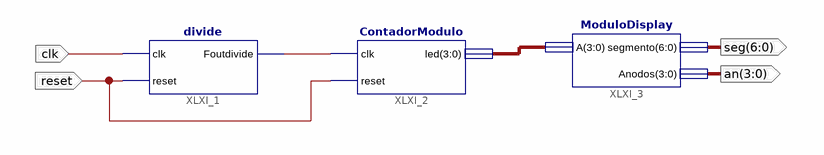
[diagram p0: schematic sheet 1]
// Xilinx ISE schematic SuperiorContadorModulo.sch (spartan6) as structural Verilog: 3 symbols, 4 ports
module SuperiorContadorModulo (
  input  clk,
  input  reset,
  output [6:0] seg,
  output [3:0] an
);

  wire XLXN_1;
  wire [3:0] XLXN_2;

  divide XLXI_1 (.clk(clk), .reset(reset), .Foutdivide(XLXN_1));
  ContadorModulo XLXI_2 (.clk(XLXN_1), .reset(reset), .led(XLXN_2));
  ModuloDisplay XLXI_3 (.A(XLXN_2), .segmento(seg), .Anodos(an));
endmodule
